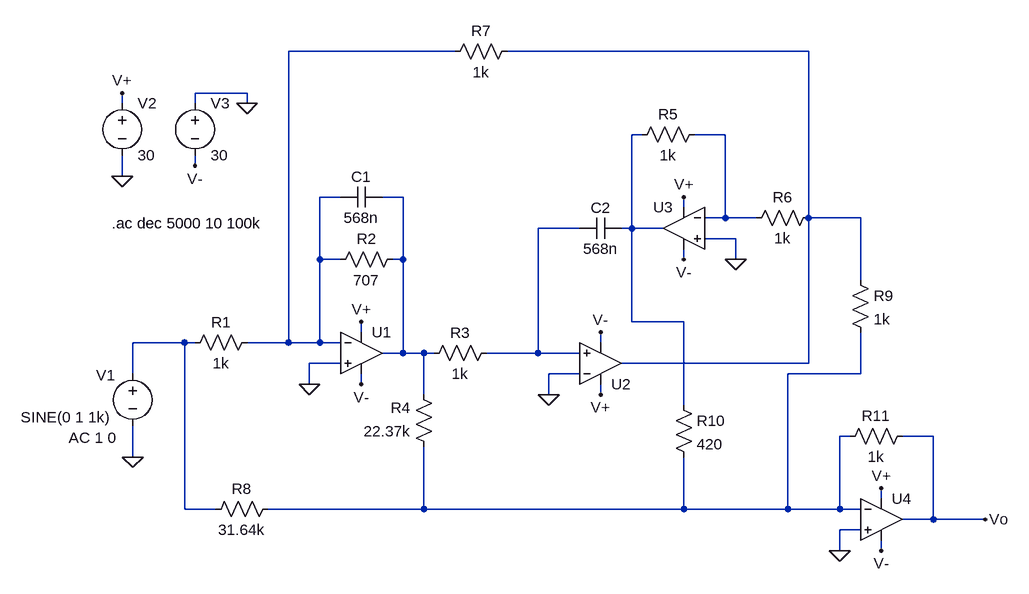
[diagram p0: schematic EJ8)c.asc]
EJ8)c.asc, the LTspice schematic file:
Version 4
SHEET 1 4188 744
WIRE 256 -368 0 -368
WIRE 800 -368 336 -368
WIRE -64 -304 -144 -304
WIRE -256 -288 -256 -304
WIRE -144 -288 -144 -304
WIRE -64 -288 -64 -304
WIRE 544 -240 528 -240
WIRE 672 -240 624 -240
WIRE -144 -192 -144 -208
WIRE -256 -176 -256 -208
WIRE 80 -144 48 -144
WIRE 176 -144 144 -144
WIRE 608 -128 608 -144
WIRE 672 -112 672 -240
WIRE 672 -112 640 -112
WIRE 720 -112 672 -112
WIRE 800 -112 800 -368
WIRE 880 -112 800 -112
WIRE 448 -96 384 -96
WIRE 528 -96 528 -240
WIRE 528 -96 512 -96
WIRE 576 -96 528 -96
WIRE 688 -80 640 -80
WIRE 48 -48 48 -144
WIRE 80 -48 48 -48
WIRE 176 -48 176 -144
WIRE 176 -48 160 -48
WIRE 608 -48 608 -64
WIRE 688 -48 688 -80
WIRE 880 -16 880 -112
WIRE 528 48 528 -96
WIRE 608 48 528 48
WIRE 112 64 112 48
WIRE -160 80 -240 80
WIRE -144 80 -160 80
WIRE 0 80 0 -368
WIRE 0 80 -64 80
WIRE 48 80 48 -48
WIRE 48 80 0 80
WIRE 80 80 48 80
WIRE 480 80 480 64
WIRE 176 96 176 -48
WIRE 176 96 144 96
WIRE 208 96 176 96
WIRE 224 96 208 96
WIRE 384 96 384 -96
WIRE 384 96 304 96
WIRE 448 96 384 96
WIRE 80 112 32 112
WIRE 800 112 800 -112
WIRE 800 112 512 112
WIRE -240 128 -240 80
WIRE 448 128 400 128
WIRE 880 128 880 64
WIRE 880 128 768 128
WIRE 32 144 32 112
WIRE 112 144 112 128
WIRE 208 160 208 96
WIRE 400 160 400 128
WIRE 480 160 480 144
WIRE 608 176 608 48
WIRE 864 224 848 224
WIRE 992 224 944 224
WIRE -240 256 -240 208
WIRE 912 320 912 304
WIRE -160 336 -160 80
WIRE -112 336 -160 336
WIRE 208 336 208 240
WIRE 208 336 -32 336
WIRE 608 336 608 256
WIRE 608 336 208 336
WIRE 768 336 768 128
WIRE 768 336 608 336
WIRE 848 336 848 224
WIRE 848 336 768 336
WIRE 880 336 848 336
WIRE 992 352 992 224
WIRE 992 352 944 352
WIRE 1072 352 992 352
WIRE 880 368 848 368
WIRE 848 400 848 368
WIRE 912 400 912 384
FLAG 112 48 V+
FLAG 112 144 V-
FLAG 32 144 0
FLAG 480 160 V+
FLAG 480 64 V-
FLAG 608 -144 V+
FLAG 608 -48 V-
FLAG 400 160 0
FLAG 688 -48 0
FLAG -240 256 0
FLAG -256 -176 0
FLAG -64 -288 0
FLAG -256 -304 V+
FLAG -144 -192 V-
FLAG 912 304 V+
FLAG 912 400 V-
FLAG 848 400 0
FLAG 1072 352 Vo
SYMBOL voltage -240 112 R0
WINDOW 0 -56 18 Left 2
WINDOW 3 -172 83 Left 2
WINDOW 123 -98 114 Left 2
WINDOW 39 0 0 Left 0
SYMATTR InstName V1
SYMATTR Value SINE(0 1 1k)
SYMATTR Value2 AC 1 0
SYMBOL res -48 64 R90
WINDOW 0 0 56 VBottom 2
WINDOW 3 32 56 VTop 2
SYMATTR InstName R1
SYMATTR Value 1k
SYMBOL OpAmps\\UniversalOpAmp 112 96 R0
SYMATTR InstName U1
SYMATTR Value2 Avol=1000000Meg GBW=10000000Meg Vos=0
SYMATTR SpiceLine En=0 Enk=0 In=0 Ink=0 Rin=500000000Meg
SYMBOL res 176 -64 R90
WINDOW 0 0 56 VBottom 2
WINDOW 3 32 56 VTop 2
SYMATTR InstName R2
SYMATTR Value 707
SYMBOL cap 144 -160 R90
WINDOW 0 0 32 VBottom 2
WINDOW 3 32 32 VTop 2
SYMATTR InstName C1
SYMATTR Value 568n
SYMBOL res 320 80 R90
WINDOW 0 0 56 VBottom 2
WINDOW 3 32 56 VTop 2
SYMATTR InstName R3
SYMATTR Value 1k
SYMBOL res 224 256 R180
WINDOW 0 36 76 Left 2
WINDOW 3 36 40 Left 2
SYMATTR InstName R4
SYMATTR Value 22.37k
SYMBOL OpAmps\\UniversalOpAmp 480 112 M180
SYMATTR InstName U2
SYMATTR Value2 Avol=1000000Meg GBW=10000000Meg Vos=0
SYMATTR SpiceLine En=0 Enk=0 In=0 Ink=0 Rin=500000000Meg
SYMBOL cap 512 -112 R90
WINDOW 0 0 32 VBottom 2
WINDOW 3 32 32 VTop 2
SYMATTR InstName C2
SYMATTR Value 568n
SYMBOL OpAmps\\UniversalOpAmp 608 -96 M0
SYMATTR InstName U3
SYMATTR Value2 Avol=1000000Meg GBW=10000000Meg Vos=0
SYMATTR SpiceLine En=0 Enk=0 In=0 Ink=0 Rin=500000000Meg
SYMBOL res 640 -256 R90
WINDOW 0 0 56 VBottom 2
WINDOW 3 32 56 VTop 2
SYMATTR InstName R5
SYMATTR Value 1k
SYMBOL res 816 -128 R90
WINDOW 0 0 56 VBottom 2
WINDOW 3 32 56 VTop 2
SYMATTR InstName R6
SYMATTR Value 1k
SYMBOL res 352 -384 R90
WINDOW 0 0 56 VBottom 2
WINDOW 3 32 56 VTop 2
SYMATTR InstName R7
SYMATTR Value 1k
SYMBOL res -16 320 R90
WINDOW 0 0 56 VBottom 2
WINDOW 3 32 56 VTop 2
SYMATTR InstName R8
SYMATTR Value 31.64k
SYMBOL res 864 -32 R0
SYMATTR InstName R9
SYMATTR Value 1k
SYMBOL voltage -256 -304 R0
WINDOW 123 0 0 Left 0
WINDOW 39 0 0 Left 0
SYMATTR InstName V2
SYMATTR Value 30
SYMBOL voltage -144 -304 R0
WINDOW 123 0 0 Left 0
WINDOW 39 0 0 Left 0
SYMATTR InstName V3
SYMATTR Value 30
SYMBOL OpAmps\\UniversalOpAmp 912 352 R0
SYMATTR InstName U4
SYMATTR Value2 Avol=1000000Meg GBW=10000000Meg Vos=0
SYMATTR SpiceLine En=0 Enk=0 In=0 Ink=0 Rin=500000000Meg
SYMBOL res 960 208 R90
WINDOW 0 0 56 VBottom 2
WINDOW 3 32 56 VTop 2
SYMATTR InstName R11
SYMATTR Value 1k
SYMBOL res 592 160 R0
SYMATTR InstName R10
SYMATTR Value 420
TEXT -272 -104 Left 2 !.ac dec 5000 10 100k

The netlist it stands for:
* EJ8)c.asc
V1 N007 0 SINE(0 1 1k) AC 1 0
R1 N001 N007 1k
XU1 0 N001 V+ V- N005 level1 Avol=1000000Meg GBW=10000000Meg Vos=0 En=0 Enk=0 In=0 Ink=0 Rin=500000000Meg  ; pins In+ In- V+ V- OUT
R2 N005 N001 707
C1 N005 N001 568n
R3 N006 N005 1k
R4 N008 N005 22.37k
XU2 N006 0 V+ V- N002 level1 Avol=1000000Meg GBW=10000000Meg Vos=0 En=0 Enk=0 In=0 Ink=0 Rin=500000000Meg  ; pins In+ In- V+ V- OUT
C2 N003 N006 568n
XU3 0 N004 V+ V- N003 level1 Avol=1000000Meg GBW=10000000Meg Vos=0 En=0 Enk=0 In=0 Ink=0 Rin=500000000Meg  ; pins In+ In- V+ V- OUT
R5 N004 N003 1k
R6 N002 N004 1k
R7 N002 N001 1k
R8 N008 N007 31.64k
R9 N002 N008 1k
V2 V+ 0 30
V3 0 V- 30
XU4 0 N008 V+ V- Vo level1 Avol=1000000Meg GBW=10000000Meg Vos=0 En=0 Enk=0 In=0 Ink=0 Rin=500000000Meg  ; pins In+ In- V+ V- OUT
R11 Vo N008 1k
R10 N003 N008 420
.ac dec 5000 10 100k
.lib UniversalOpAmp1.lib
.backanno
.end